# Altium project ft245.PrjPcb
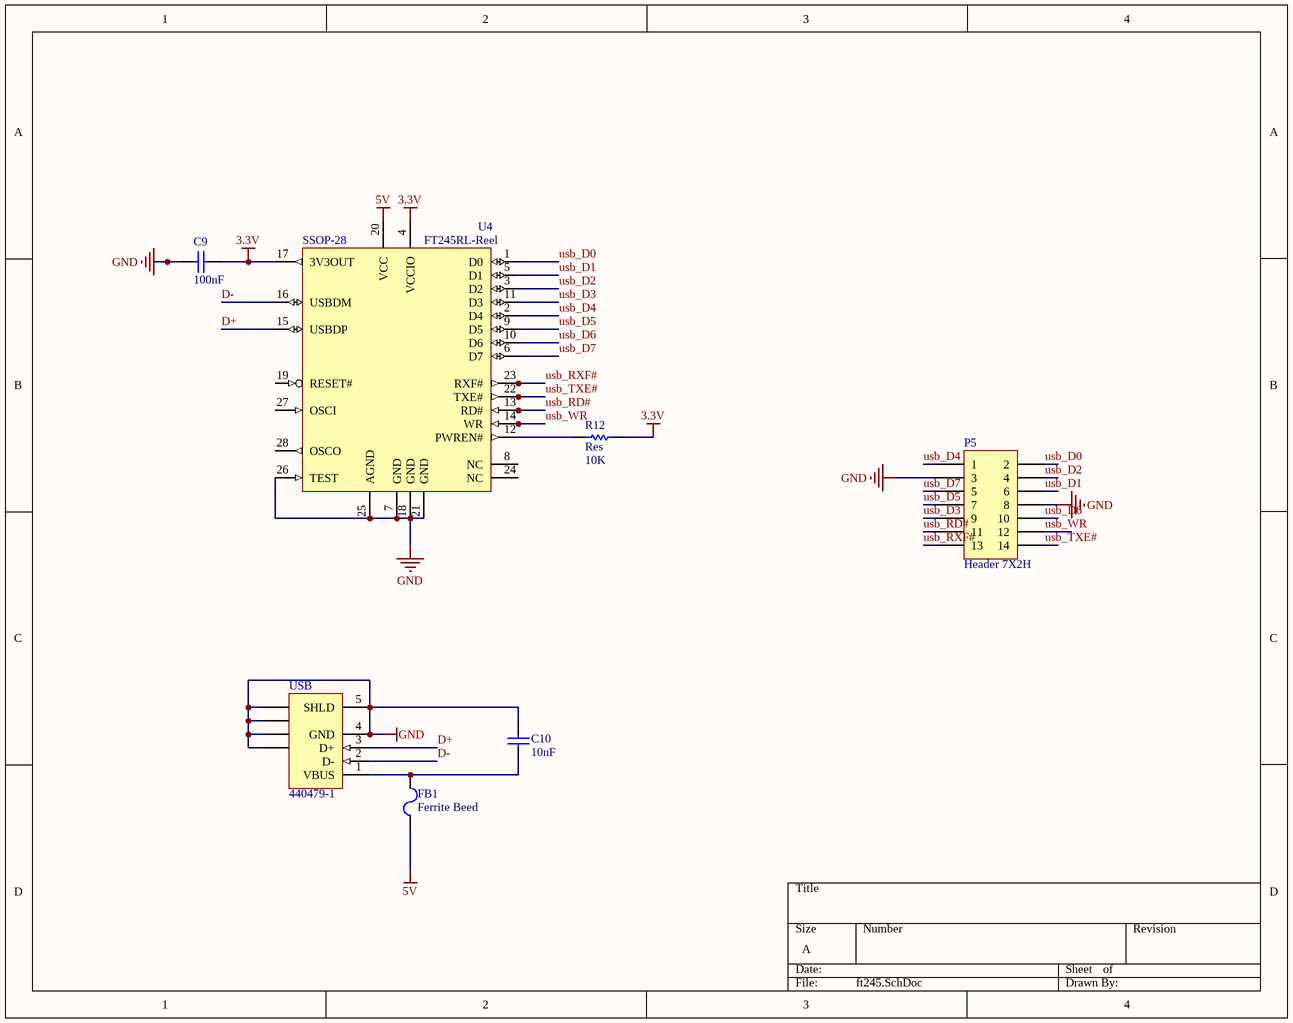
[diagram p0: ft245.SchDoc]
1 sheet, 7 parts. Net scope: global (net labels, ports and power ports of the same name join across sheets).
Board file: PCB1.PcbDoc

## Sheet ft245.SchDoc
size A

### Parts
C9  value 100nF  [2012[0805]]  (hidden comment: Cap_UP)
C10  value 10nF  [2012[0805]]  (hidden comment: Cap_UP)
FB1  Ferrite Beed  [2012[0805]]
P5  Header 7X2H  [HDR2X7H]
R12  Res  value 10K  [2012[0805]]
U4  FT245RL-Reel  PackageReference: SSOP-28  [SSOP-28_N]
USB  440479-1  [USB_Mini]

### Nets
3.3V: C9.2 R12.2 U4.4(VCCIO) U4.17(3V3OUT)
5V: FB1.2 U4.20(VCC)
GND: C9.1 C10.2 P5.3 P5.8 U4.7(GND) U4.18(GND) U4.21(GND) U4.25(AGND) U4.26(TEST) USB.4(GND) USB.5(SHLD) USB.6(SHLD) USB.7(SHLD) USB.8(SHLD) USB.9(SHLD)
D+: U4.15(USBDP) USB.3(D+)
D-: U4.16(USBDM) USB.2(D-)
usb_D0: P5.2 U4.1(D0)
usb_D1: P5.6 U4.5(D1)
usb_D2: P5.4 U4.3(D2)
usb_D3: P5.9 U4.11(D3)
usb_D4: P5.1 U4.2(D4)
usb_D5: P5.7 U4.9(D5)
usb_D6: P5.10 U4.10(D6)
usb_D7: P5.5 U4.6(D7)
usb_RD#: P5.11 U4.13(RD#)
usb_RXF#: P5.13 U4.23(RXF#)
usb_TXE#: P5.14 U4.22(TXE#)
usb_WR: P5.12 U4.14(WR)
NetC10_1: C10.1 FB1.1 USB.1(VBUS)
NetR12_1: R12.1 U4.12(PWREN#)

Not connected (* = marked no-connect by the designer): U4 8(NC) 19(RESET#) 24(NC) 27(OSCI) 28(OSCO)

### Library data of the parts
C9 C10 = Cap_UP: Capacitor; Published: 8-Jun-2000; LatestRevisionDate: 17-Jul-2002; LatestRevisionNote: Re-released for DXP Platform.; PackageReference: RAD-0.3; Publisher: Altium Limited
FB1 = Ferrite Beed: Code_IEC: 1005; Published: 8-Jun-2000; LatestRevisionDate: 17-Jul-2002; LatestRevisionNote: Re-released for DXP Platform.; PackageReference: 0402-A; Publisher: Altium Limited; Code_JEITA: 0402
P5 = Header 7X2H: Header, 7-Pin, Dual row, Right Angle; LatestRevisionDate: 17-Jul-2002; LatestRevisionNote: Re-released for DXP Platform.; Publisher: Altium Limited
R12 = Res: Semiconductor Resistor; Published: 8-Jun-2000; LatestRevisionDate: 17-Jul-2002; LatestRevisionNote: Re-released for DXP Platform.; PackageReference: AXIAL-0.5; Publisher: Altium Limited
U4 = FT245RL-Reel: USB/Parallel FIFO Bi-Directional Data Transfer Chip, SSOP-28, Tape and Reel; Published: 19-Aug-2010; DatasheetVersion: ver 2.10, Jul-2010; PackageVersion: 2010; Publisher: Altium Limited; PackageDescription: 28-Pin Small Outline Package 0.65 mm Pitch; ComponentLink1Description: Manufacturer Link; ComponentLink1URL: http://www.ftdichip.com/Products/ICs/FT245R.htm; ComponentLink2Description: Datasheet; ComponentLink2URL: http://www.ftdichip.com/Support/Documents/DataSheets/ICs/DS_FT245R.pdf
USB = 440479-1: USB 2.0, Right Angle, SMT, AB Type, Receptacle, 5 Position, Black; ContactMaterial: Phosphor Bronze; ContactPlating: Gold (30) over Nickel; PCB_Layout: Complies with manufacturer's recommendation.; DrillSize: Corresponds to nominal value.; PanelGround: Without; Published: 15-Jul-2004; DatasheetDocument: 28-Jan-2003; PackageDocument: 28-Jan-2003; PackageReference: 440479; Publisher: Altium Limited; HousingMaterial: Thermoplastic; ComponentLink1Description: Manufacturer Link; ComponentLink1URL: http://www.tycoelectronics.com/; ComponentLink2Description: Packaging Specification; ComponentLink2URL: http://ecommas.tycoelectronics.com/commerce/DocumentDelivery/DDEController?Action=showdoc&DocId=Customer+Drawing%7F440479%7FD%7Fpdf%7FEnglish%7FC_440479_D.pdf